# EAGLE design Adafruit Ultimate GPS (EAGLE 6.2)
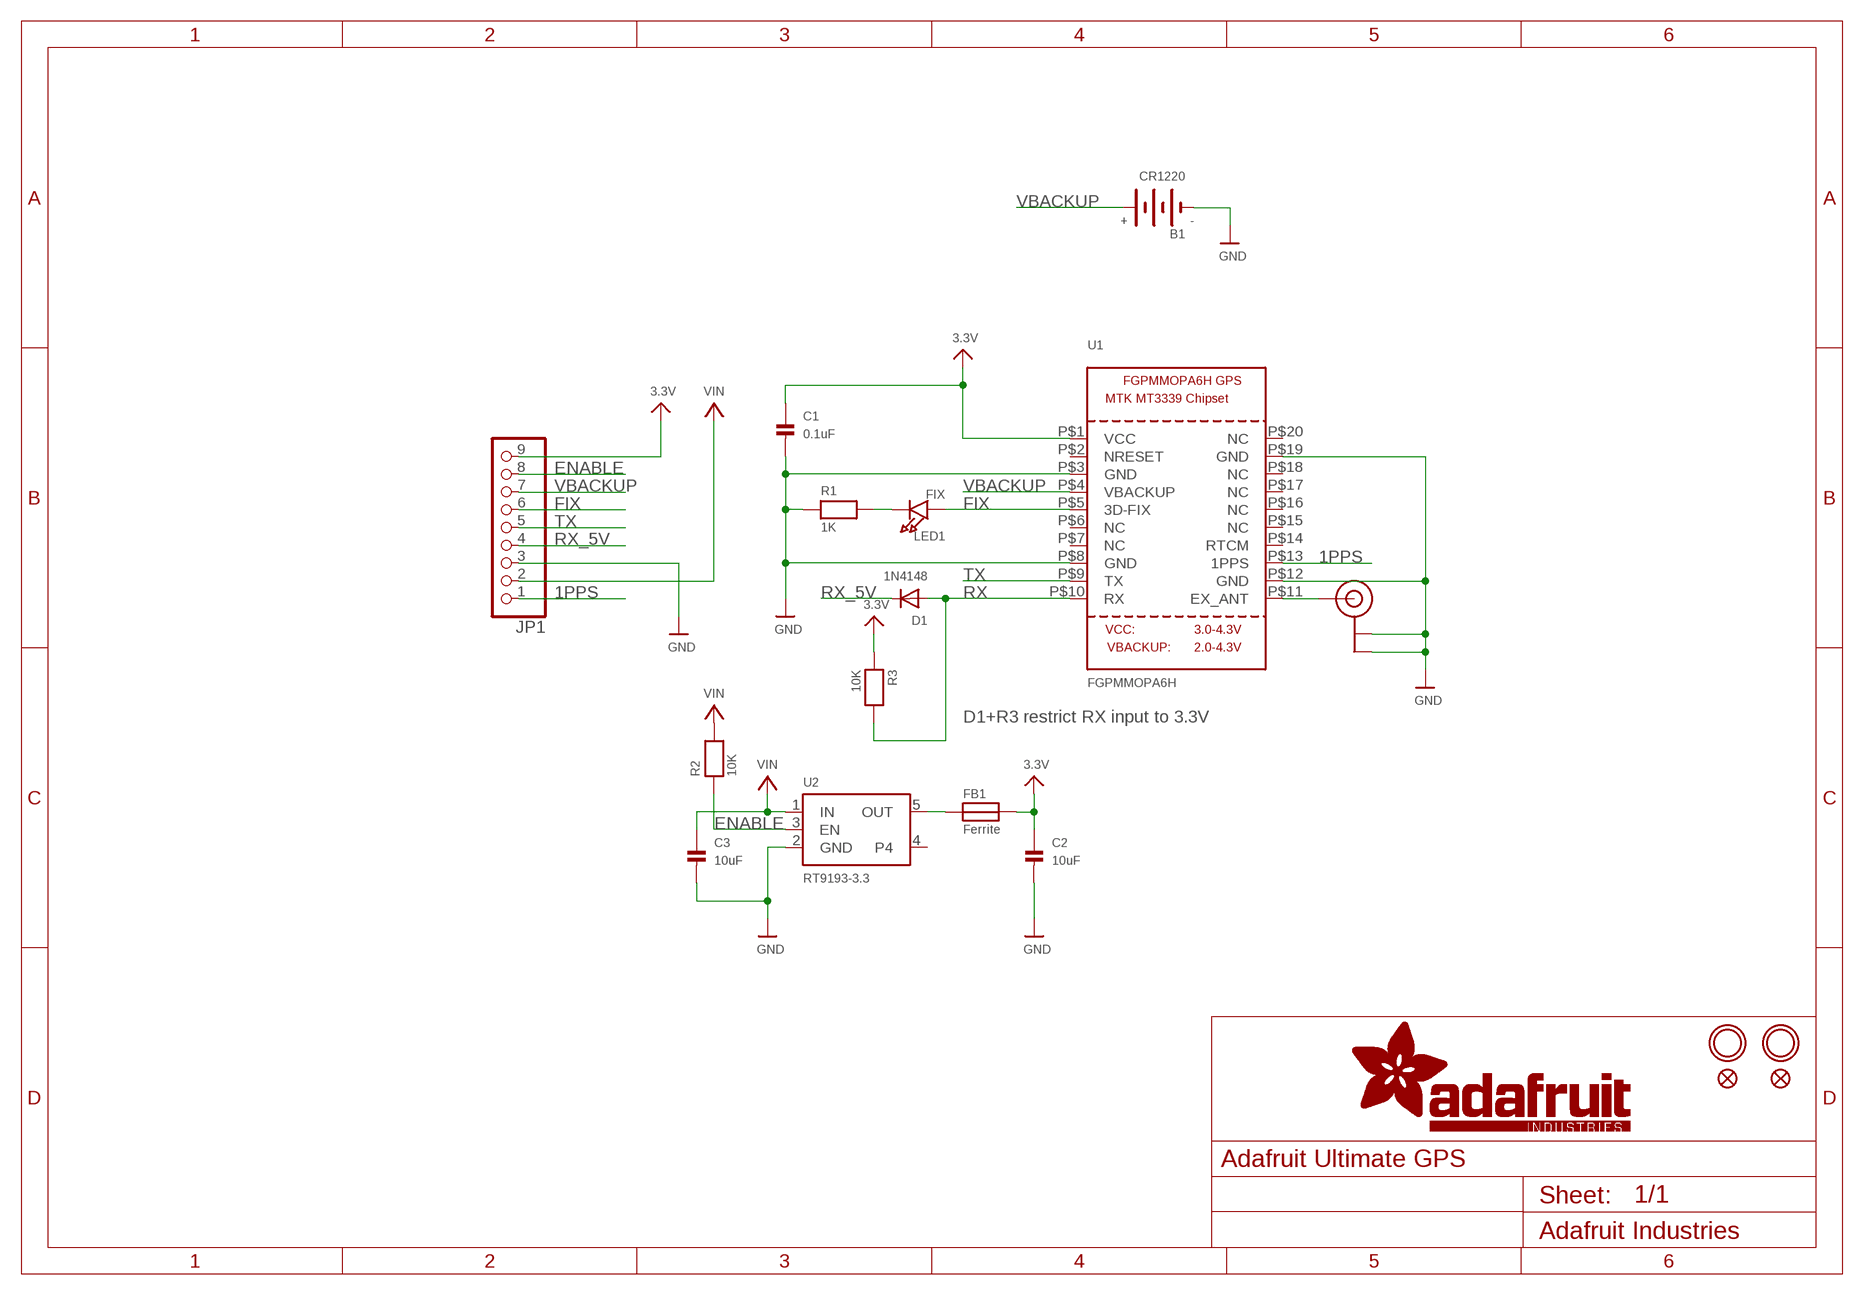
[diagram p0: schematic, sheet 1]

## Parts
B1  CR1220  BATTERYCR1220_SMT  [CR1220]
C1  0.1uF  CAP_CERAMIC0805  [0805]
C2  10uF  CAP_CERAMIC0805  [0805]
C3  10uF  CAP_CERAMIC0805  [0805]
D1  1N4148  DIODESOD-323F  [SOD-323F]
FB1  Ferrite  FERRITE0805  [0805]
FID1  FIDUCIAL""  [FIDUCIAL_1MM]
FID2  FIDUCIAL""  [FIDUCIAL_1MM]
JP1  HEADER-1X970MIL  [1X09_ROUND_70]
LED1  FIX  LED0805  [CHIPLED_0805]
R1  1K  RESISTOR0805  [0805]
R2  10K  RESISTOR0805  [0805]
R3  10K  RESISTOR0805  [0805]
U1  FGPMMOPA6H  GPS_FGPMMOPA6H  [FGPMMOPA6H]
U2  RT9193-3.3  VREG_SOT23-5  [SOT23-5]
U$8  MOUNTINGHOLE2.0  [MOUNTINGHOLE_2.0_PLATED]
U$9  MOUNTINGHOLE2.0  [MOUNTINGHOLE_2.0_PLATED]
U$20  U.FL  [U.FL]

## Nets
1PPS: JP1.1 U1.P$13(1PPS)
3.3V: C1.1 C2.1 FB1.2 JP1.9 R3.1 U1.P$1(VCC)
ENABLE: JP1.8 R2.1 U2.3(EN)
FIX: JP1.6 LED1.A U1.P$5(3D-FIX)
GND: B1.- C1.2 C2.2 C3.2 JP1.3 R1.1 U1.P$3(GND) U1.P$8(GND) U1.P$12(GND) U1.P$19(GND) U2.2(GND) U$20.P$1(GND) U$20.P$2(GND)
N$2: LED1.C R1.2
N$3: FB1.1 U2.5(OUT)
N$4: U1.P$11(EX_ANT) U$20.P$3(SIGNAL)
RX: D1.A R3.2 U1.P$10(RX)
RX_5V: D1.C JP1.4
TX: JP1.5 U1.P$9(TX)
VBACKUP: B1.+$1(+) JP1.7 U1.P$4(VBACKUP)
VIN: C3.1 JP1.2 R2.2 U2.1(IN)
Unconnected: U1.P$2(NRESET) U1.P$6(NC) U1.P$7(NC) U1.P$14(RTCM) U1.P$15(NC) U1.P$16(NC) U1.P$17(NC) U1.P$18(NC) U1.P$20(NC) U2.4

## Notes on the sheet
- D1+R3 restrict RX input to 3.3V

## Library data of the parts
B1 = microbuilder:BATTERY
C1-C3 = microbuilder:CAP_CERAMIC: Ceramic Capacitors 0402 - 0402 Surface Mount Capacitors 16pF 50V 5% [Digikey: 445-4899-2-ND] 18pF 50V 5% [Digikey: 490-1281-2-ND] 22pF 50V 5% [Digikey: 490-1283-2-ND] 68pF 50V 5% [Digikey: 490-1289-2-ND] 0.1uF 10V 10% [Digikey: 490-1318-2-ND] 1.0uF 6.3V 10% [Digikey: 490-1320-2-ND] 0603 - 0603 Surface Mount Capacitors 16 pF 50V 5% [Digikey: 445-5051-2-ND] 22 pF 50V [Digikey: PCC220ACVTR-ND] 33 pF 50V 5% [Digikey: 490-1415-1-ND] 56pF 50V 5% [Digikey: 490-1421-1-ND] 220pF 50V 5% [Digikey: 445-1285-1-ND] 680 pF 50V 2200 pF 50V 5% C0G [Digikey: 445-1297-1-ND] 5600 pF 100V 5% X7R [Digikey: 478-3711-1-ND] 0.1 µF 25V 10% [Digikey: PCC2277TR-ND] 0.22 µF 16V 10% X7R [Digikey: 445-1318-1-ND] 1.0 µF 25V 10% [Digikey: 445-5146-2-ND] 0603 - RF Specific 3pF 250V +/-0.1pF RF [Digikey: 712-1347-1-ND] 18 pF 250V 5% [Digikey: 478-3505-1-ND or 712-1322-1-ND] 56 pF 250V 5% C0G RF [Digikey: 490-4867-1-ND] 68 pF 250V RF [Digikey: 490-4868-1-ND] 0805 - 0805 Surface Mount Capacitors 220 pF 250V 2% RF Ceramic Capacitor [Digikey: 712-1398-1-ND] 1000 pF 50V 2% NP0 Ceramic Capacitor [Digikey: 478-3760-1-ND] 0.1 µF 25V 10% Ceramic Capacitor [Digikey: PCC1828TR-ND] 1.0 µF 16V 10% Ceramic Capacitor[Digikey: 490-1691-2-ND] 10.0 µF 10V 10% Ceramic Capacitor[Digikey: 709-1228-1-ND] 10.0 uF 16V 10% Ceramic Capacitor [Digikey: 478-5165-2-ND] 47 uF 6.3V 20% Ceramic Capacitor [Digikey: 587-1779-1-ND or 399-5506-1-ND] 1206 - 1206 Surface Mount Capacitors 47uF 10V 20% Ceramic Capacitor [Digikey: 490-5528-1-ND or 399-5508-1-ND or 445-6010-1-ND] 100uF 6.3V -20%, +80% Y5V Ceramic Capacitor (Digikey: 490-4512-1-ND, Mouser: 81-GRM31CF50J107ZE1L)
D1 = adafruit:DIODE: Diode SMADIODE - SMA Surface Mount Package 20V 1A Schottky Diode Digikey: 641-1014-6-ND DO-1N4148 - Through Hole Small Current Diode SOD-123 20V 1 A (.5mV Vf) Schottky Diode - Digikey: MBRX120TPMSCT-ND SOD-323 10V 570mA (.38mV Vf, 3ns) Schottky Diode - Digikey: ZLLS410CT-ND SOD-523 30V 30mA Schottky Diode (RB751S-40TE61) - Digikey: RB751S-40TE61CT-ND SOT23-R/W - SOT23 Package (R = Solder Paste/Reflow Ovens, W = Hand-Soldering) BAT54Film 40V 300mA - Digikey: 497-7162-1-ND
FB1 = microbuilder:FERRITE: Ferrite Bead 0603 MMZ1608B121C - 120 Ohm, 600mA Ferrite Chip - Digikey: 445-2164-1-ND BK1608HW121-T - 120 Ohm, 600mA Ferrite Chip - Digikey: 587-1876-2-ND
FID1 FID2 = microbuilder:FIDUCIAL: Fiducial Alignment Points Various fiducial points for machine vision alignment.
JP1 = microbuilder:HEADER-1X9: PIN HEADER
LED1 = microbuilder:LED: LED 0603 - 0603 Surface Mount Package 2mA: Green LED - Low Power (3.9mcd, 2ma, 1.7Vf) - Digikey: 475-2709-2-ND Orange LED - Low Power (9.8mcd, 2ma, 1.8Vf) - Digikey: 475-1194-2-ND Red LED - Low Power (5mcd, 2ma, 1.8Vf) - Digikey: 475-1195-2-ND Yellow LED - Low Power (7mcd, 2ma, 1.8Vf) - Digikey: 475-1196-2-ND 5mA: Blue LED - Low Power (17mcd, 5ma, 2.9Vf) - Digikey: LNJ937W8CRACT-ND 0805 - 0805 Surface Mount Package 2mA: Red LED (8.8mcd, 2mA, 1.8Vf, Clear) - Low Power [Digikey: 475-2510-1-ND] Green LED (5mcd, 2mA, 1.8Vf, Clear) - Low Power [Digikey: 475-2730-1-ND] Yellow LED (11.3mcd, 2mA, 1.8Vf, Clear) - Low Power [Digikey: 475-2555-1-ND] 20mA: Red LED (104mcd, 20mA, Diffused) - LS R976 [Digikey: 475-1278-6-ND] Red LED (12mcd, 20mA, 2.0Vf, Clear) - APT2012EC [Digikey: 754-1128-1-ND] Green LED (15mcd, 20mA, 2.2Vf, Clear) - APT2012GC [Digikey: 754-1131-1-ND] Orange LED (160mcd, 20mA, 2.1Vf, Clear) - APT2012SECK [Digikey: 754-1130-1-ND] 1206 - 1206 Surface Mount Package Green LED (26mcd, 20mA, Diffused) - LG N971 [Digikey: 475-1407-6-ND] Red LED (15mcd, 20mA, Diffused) - LH N974 [Digikey: 475-1416-6-ND]
R1-R3 = microbuilder:RESISTOR: Resistors 0402 - 0402 Surface Mount Package 22 Ohm 1% 1/16W [Digikey: 311-22.0LRTR-ND] 33 Ohm 5% 1/16W 1.0K 5% 1/16W 1.5K 5% 1/16W 2.0K 1% 1/16W 10.0K 1% 1/16W [Digikey: 311-10.0KLRTR-ND] 10.0K 5% 1/16W [Digikey: RMCF0402JT10K0TR-ND] 12.1K 1% 1/16W [Digikey: 311-22.0LRTR-ND] 100.0K 5% 1/16W 0603 - 0603 Surface Mount Package 0 Ohm 1/10 Watt 1% Resistor 15 Ohm 1/10 Watt 1% Resistor 33 Ohm 1/10 Watt 1% Resistor 49.9 Ohm 1/10 Watt 1% Resistor 100 Ohm 1/10 Watt 1% Resistor 150 Ohm 1/10 Watt 1% Resistor 240 Ohm 1/10 Watt 1% Resistor 390 Ohm 1/10 Watt 1% Resistor 560 Ohm 1/10 Watt 1% Resistor 680 Ohm 1/10 Watt 1% Resistor 750 Ohm 1/10 Watt 1% Resistor 1.0K Ohm 1/10 Watt 1% Resistor 1.5K Ohm 1/10 Watt 1% Resistor 2.0K Ohm 1/10 Watt 1% Resistor 2.2K Ohm 1/10 Watt 1% Resistor 3.3K Ohm 1/10 Watt 1% Resistor 4.7K Ohm 1/10 Watt 1% Resistor 10.0K Ohm 1/10 Watt 1% Resistor 12.0K Ohm 1/10 Watt 1% Resistor 12.1K Ohm 1/10 Watt 1% Resistor 20.0K Ohm 1/10 Watt 1% Resistor 33.0K Ohm 1/10 Watt 1% Resistor 100.0K Ohm 1/10 Watt 1% Resistor 0805 - 0805 Surface Mount Package 0 Ohm 1/8 Watt 1% Resistor 33 Ohm 1/8 Watt 1% Resistor 100 Ohm 1/8 Watt 1% Resistor 150 Ohm 1/8 Watt 1% Resistor 200 Ohm 1/8 Watt 1% Resistor 240 Ohm 1/8 Watt 1% Resistor 330 Ohm 1/8 Watt 1% Resistor 390 Ohm 1/8 Watt 1% Resistor 470 Ohm 1/8 Watt 1% Resistor 1.0K Ohm 1/8 Watt 1% Resistor 1.5K Ohm 1/8 Watt 1% Resistor 2.0K Ohm 1/8 Watt 1% Resistor 4.7K Ohm 1/8 Watt 1% Resistor 5.1K Ohm 1/8 Watt 1% Resistor 5.6K Ohm 1/8 Watt 1% Resistor 10.0K Ohm 1/8 Watt 1% Resistor 22.0K Ohm 1/8 Watt 1% Resistor 33.0K Ohm 1/8 Watt 1% Resistor 100K Ohm 1/8 Watt 1% Resistor 1206 - 1206 Surface Mount Package 2012 - 2010 Surface Mount Package 0.11 Ohm 1/2 Watt 1% Resistor - Digikey: RHM.11UCT-ND
U1 = microbuilder:GPS_FGPMMOPA6H: GPS Module - MTK MT3339 Chipset, -165dBm sensitivity, 22 channels, 10Hz, auto-select external antenna options
U2 = microbuilder:VREG_SOT23-5: SOT23-5 Fixed Voltage Regulators To better organise some of the SOT23-5 fixed voltage regulators in this library, this new part was created. Part Current Out V Out V In V Dropout Digikey Part No. ADP121 150mA 3.3V 3.4-5.5V 0.09V @ 150mA ADP121-AUJZ33R7CT-ND ADP121 150mA 3.0V 3.1-5.5V 0.09V @ 150mA ADP121-AUJZ30R7CT-ND ADP122 300mA 3.3V 3.4-5.5V 0.085V @ 300mA ADP122AUJZ-3.3-R7CT-ND ADP1712 300mA 3.3V 3.5-5.5V 0.17V @ 300mA ADP1712AUJZ-3.3-R7TR-ND AP7311 (Low Cost) 150mA 3.3V 3.5-6V 0.15V @ 150mA AP7311-33WG-7DICT-ND LD39015M18R 150mA 1.8V 1.9V-5.5V 0.08V @ 100mA 497-6977-1-ND MCP1824T-3302E/OT 300mA 3.3V 3.5V-6V 0.2V @ 300mA MCP1824T-3302E/OTCT-ND MIC5205-2.5YM5 TR 150mA 2.5V 2.7-16V 0.165V @ 150mA 576-1257-2-ND MIC5205-3.0YM5 TR 150mA 3.0V 3.2V-16V 0.165V @ 150mA 576-1258-2-ND MIC5205-3.3YM5 TR 150mA 3.3V 3.5V-16V 0.165V @ 150mA 576-1259-2-ND TPS780330220 150mA 3.3V+2.2V 3.6-5.5V 250mV Max 296-23332-1-ND TDA3663/N1,135 100mA 3.3V 3.5-45V 0.18V @ 50mA 568-5343-1-ND
U$8 U$9 = microbuilder:MOUNTINGHOLE: Mounting Hole For #2 screws (0.086"/2.18mm width, 0.094"/2.4mm hole) use 2.5mm
U$20 = microbuilder:U.FL: U.FL Antenna Connector

## Board
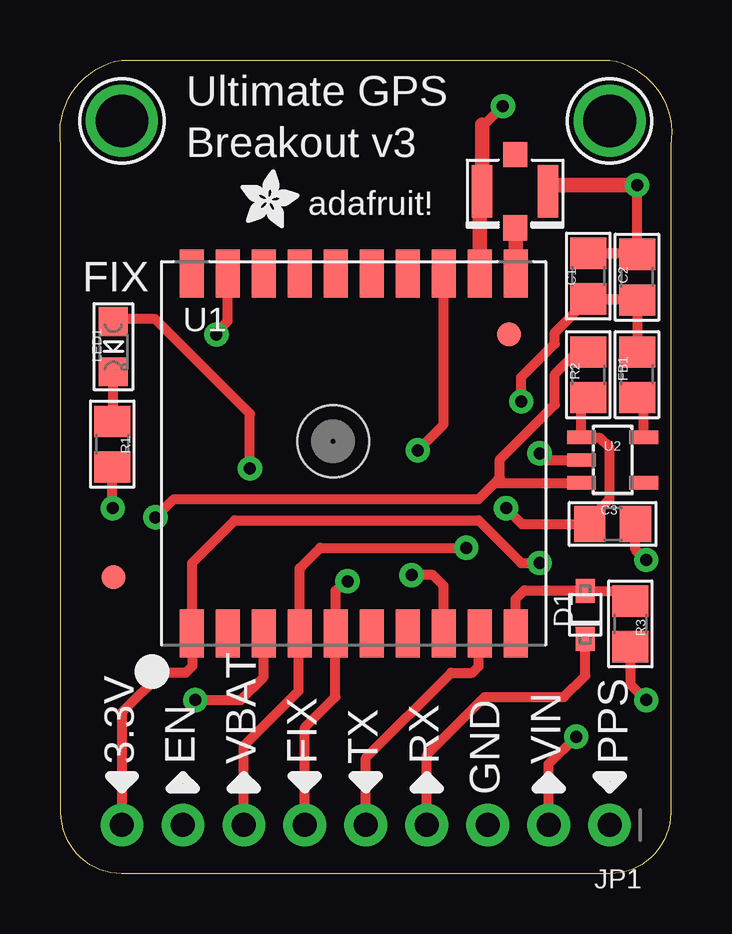
[diagram p1: board, top side]
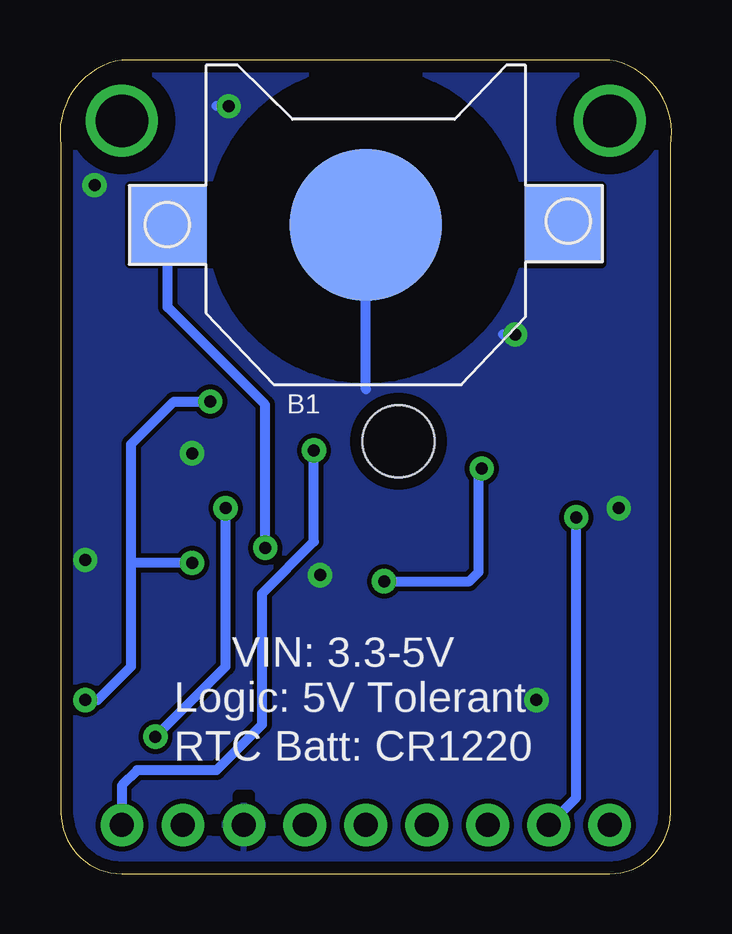
[diagram p2: board, bottom side, seen from below]

Size 25.48 x 33.92 mm. Coordinates in mm from the lower left corner, seen from the top.
Outline: 0.04,2.54 0.04,30.37 arc-90 2.58,33.92 22.9,33.92 arc-90 25.44,30.37 25.44,2.54 arc-90 22.9,0 2.58,0 arc-90 0.04,2.54
Copper layers (1*16): Top 0.035mm / dielectric 1.5mm / Bottom 0.035mm
Design rules: minimum track width 8mil, minimum drill 0.4mm, track to track 8mil, track to pad 8mil, pad to pad 8mil, via to via 8mil, smd to smd 8mil, copper to edge 20mil, drill to drill 8mil, minimum pad ring 8mil, minimum via ring 10mil, stop-mask expansion 3mil, vias tented up to drill 20mil, thermal gap 8mil
bRestrict: area 17.6,3.2 to 18.1,3.3; area 16.6,1.8 to 16.7,2.3; area 19,1.8 to 19.1,2.3

### Footprints (pad centres in the part's own frame; a part is rotated, then mirrored left to right if it is on the bottom)
CR1220 = smd 3.2 x 3.2: +$1 -8.225,0; +$2 8.225,0 | smd 6.35 x 6.35: - 0,0
0805 = smd 1.3 x 1.5: 1 -0.95,0; 2 0.95,0
SOD-323F = smd 1 x 0.8: A -1,0; C 1,0
FIDUCIAL_1MM = smd 1 x 1: 1 0,0
1X09_ROUND_70 = drill 1 pad 1.778: 1 -10.16,0; 2 -7.62,0; 3 -5.08,0; 4 -2.54,0; 5 0,0; 6 2.54,0; 7 5.08,0; 8 7.62,0; 9 10.16,0
CHIPLED_0805 = smd 1.2 x 1.2: A 0,-1.05; C 0,1.05
FGPMMOPA6H = smd 2 x 1: P$1 -7.5,6.75; P$2 -7.5,5.25; P$3 -7.5,3.75; P$4 -7.5,2.25; P$5 -7.5,0.75; P$6 -7.5,-0.75; P$7 -7.5,-2.25; P$8 -7.5,-3.75; P$9 -7.5,-5.25; P$10 -7.5,-6.75; P$11 7.5,-6.75; P$12 7.5,-5.25; P$13 7.5,-3.75; P$14 7.5,-2.25; P$15 7.5,-0.75; P$16 7.5,0.75; P$17 7.5,2.25; P$18 7.5,3.75; P$19 7.5,5.25; P$20 7.5,6.75 | hole 3: 0.5,0.85
SOT23-5 = smd 0.55 x 1.2: 1 -0.95,-1.3; 2 0,-1.3; 3 0.95,-1.3; 4 0.95,1.3; 5 -0.95,1.3
MOUNTINGHOLE_2.0_PLATED = drill 2.2 pad 3: P$1 0,0
U.FL = smd 2.2 x 0.85: P$1 0,1.375; P$2 0,-1.375 | smd 1.05 x 1: P$3 1.525,0; P$4 -1.525,0

### Placement (x,y rotation side)
B1  12.74,27.05 0 bottom
C1  22.01,24.92 90 top
C2  24.04,24.87 90 top
C3  23.03,14.58 0 top
D1  21.89,10.79 270 top
FB1  24.04,20.8 90 top
FID1  18.71,22.48 0 top
FID2  2.22,12.36 0 top
JP1  12.74,2.03 180 top
LED1  2.22,21.97 180 top
R1  2.18,17.91 90 top
R2  22.01,20.8 270 top
R3  23.77,10.41 90 top
U1  12.23,17.53 90 top
U2  23.03,17.25 270 top
U$8  2.58,31.39 0 top
U$9  22.9,31.39 0 top
U$15  [ADAFRUIT_2.5MM]  7.53,26.92 0 top
U$20  18.96,28.45 270 top

### Tracks (layer width: path | path; a pad name or v marks a point on that pad's centre or on a via)
1PPS  (via drill 0.5)
  Top 0.406: U1.P$13 15.98,18.74 v14.9,17.65
  Bottom 0.406: v14.9,17.65 14.9,13.84 17.06,11.68 17.06,6.22 18.96,4.32 22.27,4.32 22.9,3.68 JP1.1
3.3V  (via drill 0.5)
  Top 0.406: FB1.2 C2.1 24,23.97 C1.1 20.62,22.57 20.62,22.1 19.22,20.7 v19.22,19.68 | 5.5,10.04 U1.P$1 | 5.5,10.04 5.5,8.64 5.25,8.38 4.23,8.38 2.58,6.73 JP1.9 | R3.1 23.77,7.9 v24.43,7.24 | 5.5,10.04 5.5,12.95 7.28,14.73 17.44,14.73 19.22,12.95 v19.98,12.95
  Bottom 0.406: v24.43,7.24 23.92,7.24 22.52,8.64 22.52,12.95 | 22.52,12.95 22.52,17.91 20.74,19.68 v19.22,19.68 | v19.98,12.95 22.52,12.95
ENABLE  (via drill 0.5)
  Top 0.406: R2.1 21.98,21.72 21.5,21.72 20.62,20.83 20.62,19.56 18.33,17.27 18.33,16.51 18.12,16.3 | 18.12,16.3 U2.3 | 18.12,16.3 17.44,15.62 4.74,15.62 v3.98,14.86
  Bottom 0.406: v3.98,14.86 3.98,3.17 JP1.8
FIX  (via drill 0.5)
  Top 0.406: JP1.6 10.2,6.1 11.47,7.37 11.47,10.01 U1.P$5 11.48,11.8 11.88,12.19 v11.98,12.19 | v7.92,16.89 7.92,19.18 3.98,23.11 2.32,23.11 LED1.A
  Bottom 0.406: v11.98,12.19 8.42,12.19 8.04,12.57 8.04,16.76 v7.92,16.89
GND  (via drill 0.5)
  Top 0.406: v24.04,28.7 C2.2 24,25.87 C1.2 | U2.2 20.26,17.25 v19.98,17.53 | C3.2 23.98,13.53 v24.43,13.08 | U1.P$8 15.98,12 15.54,12.45 v14.65,12.45 | U1.P$3 8.48,8.19 7.53,7.24 v5.63,7.24 | U1.P$19 6.98,23.03 6.52,22.57 v6.52,22.48 | R1.1 2.18,15.22 v2.2,15.24 | 17.59,31.14 v18.46,32 | 17.57,28.55 17.57,28.47 U$20.P$2 | 20.72,28.7 20.59,28.7 U$20.P$1
  Top 0.61: v24.04,28.7 20.72,28.7 | U1.P$12 17.48,28.87 17.57,28.96 17.57,28.55 | U$20.P$2 17.59,31.14 17.59,31.22
  Bottom 0.406: v24.04,28.7 24.04,28.45 | v19.98,17.53 19.98,17.78 | v24.43,13.08 24.43,12.95 24.55,12.83 | v14.65,12.45 14.65,12.7 | 12.74,20.19 B1.- | v5.63,7.24 5.63,6.99 | v6.52,22.48 7.03,22.48 | v18.46,32 18.96,32
  pour Bottom (isolate 0.203): 0.04,0 0.04,33.92 25.44,33.92 25.44,0
N$2
  Top 0.406: LED1.C 2.22,18.91 R1.2
N$3
  Top 0.406: U2.5 24.33,19.57 FB1.1
N$4
  Top 0.406: U$20.P$3 18.96,26.8 18.98,26.78
  Top 0.61: U1.P$11 18.98,26.78
RX
  Top 0.406: R3.2 23.34,11.79 D1.A 21.87,11.81 19.35,11.81 18.98,11.45 U1.P$10
RX_5V
  Top 0.406: JP1.4 15.28,4.95 17.69,7.37 21,7.37 21.89,8.26 D1.C
TX
  Top 0.406: JP1.5 12.74,4.83 16.3,8.38 17.19,8.38 17.44,8.64 17.44,9.98 U1.P$9
VBACKUP  (via drill 0.5)
  Top 0.406: JP1.7 7.66,5.33 9.95,7.62 9.95,9.99 U1.P$4 9.98,12.74 10.84,13.59 v16.93,13.59
  Bottom 0.406: v16.93,13.59 16.93,19.56 21,23.62 21,27.02 B1.+$1
VIN  (via drill 0.5)
  Top 0.406: R2.2 21.73,19.57 U2.1 21.77,18.16 22.52,18.16 22.9,17.78 22.9,15.62 22.08,14.8 C3.1 19.24,14.58 v18.58,15.24 | JP1.2 20.36,4.57 v21.5,5.71
  Bottom 0.406: v18.58,15.24 18.58,8.64 v21.5,5.71

### Text on the board
tPlace: Ultimate GPS | Breakout v3 | adafruit! | FIX | 3.3V | EN | VBAT | FIX | TX | RX | VIN | PPS | GND
bPlace: VIN: 3.3-5V | Logic: 5V Tolerant | RTC Batt: CR1220